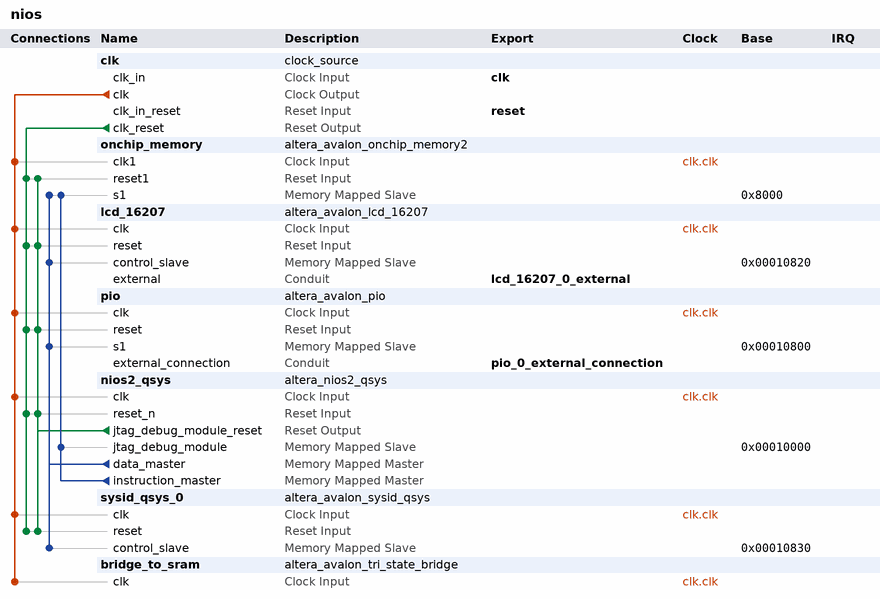
[diagram p0: system contents]
# Platform Designer (Qsys) system nios, Cyclone II EP2C35F672C6
# Parameters at their usual value, and those the tool derives, are not listed.
package require -exact qsys 13.0
create_system nios
set_project_property DEVICE_FAMILY {Cyclone II}
set_project_property DEVICE EP2C35F672C6

add_instance clk clock_source 13.0
set_instance_parameter_value clk clockFrequency 50000000

add_instance onchip_memory altera_avalon_onchip_memory2 13.0.1.99.2
set_instance_parameter_value onchip_memory dataWidth 32
set_instance_parameter_value onchip_memory dualPort false
set_instance_parameter_value onchip_memory initMemContent true
set_instance_parameter_value onchip_memory initializationFileName D:/DE2/nios_test/software/HelloWorld/mem_init/nios_onchip_memory.hex
set_instance_parameter_value onchip_memory memorySize 32768
set_instance_parameter_value onchip_memory useNonDefaultInitFile true

add_instance lcd_16207 altera_avalon_lcd_16207 13.0.1.99.2

add_instance pio altera_avalon_pio 13.0.1.99.2
set_instance_parameter_value pio bitModifyingOutReg true
set_instance_parameter_value pio direction Output
set_instance_parameter_value pio width 17

add_instance nios2_qsys altera_nios2_qsys 13.0
set_instance_parameter_value nios2_qsys resetSlave onchip_memory.s1
set_instance_parameter_value nios2_qsys mmu_TLBMissExcSlave None
set_instance_parameter_value nios2_qsys exceptionSlave onchip_memory.s1
set_instance_parameter_value nios2_qsys breakSlave nios2_qsys.jtag_debug_module
set_instance_parameter_value nios2_qsys impl Tiny
set_instance_parameter_value nios2_qsys icache_size 4096

add_instance sysid_qsys_0 altera_avalon_sysid_qsys 13.0
set_instance_parameter_value sysid_qsys_0 id 591751049

add_instance bridge_to_sram altera_avalon_tri_state_bridge 13.0
set_instance_parameter_value bridge_to_sram registerIncomingSignals true

# connections
add_connection clk.clk bridge_to_sram.clk clock
add_connection clk.clk lcd_16207.clk clock
add_connection clk.clk nios2_qsys.clk clock
add_connection clk.clk onchip_memory.clk1 clock
add_connection clk.clk pio.clk clock
add_connection clk.clk sysid_qsys_0.clk clock
add_connection clk.clk_reset lcd_16207.reset reset
add_connection clk.clk_reset nios2_qsys.reset_n reset
add_connection clk.clk_reset onchip_memory.reset1 reset
add_connection clk.clk_reset pio.reset reset
add_connection clk.clk_reset sysid_qsys_0.reset reset
add_connection nios2_qsys.jtag_debug_module_reset lcd_16207.reset reset
add_connection nios2_qsys.jtag_debug_module_reset nios2_qsys.reset_n reset
add_connection nios2_qsys.jtag_debug_module_reset onchip_memory.reset1 reset
add_connection nios2_qsys.jtag_debug_module_reset pio.reset reset
add_connection nios2_qsys.jtag_debug_module_reset sysid_qsys_0.reset reset
add_connection nios2_qsys.data_master lcd_16207.control_slave avalon
set_connection_parameter_value nios2_qsys.data_master/lcd_16207.control_slave baseAddress 0x00010820
add_connection nios2_qsys.data_master onchip_memory.s1 avalon
set_connection_parameter_value nios2_qsys.data_master/onchip_memory.s1 baseAddress 0x8000
add_connection nios2_qsys.data_master pio.s1 avalon
set_connection_parameter_value nios2_qsys.data_master/pio.s1 baseAddress 0x00010800
add_connection nios2_qsys.data_master sysid_qsys_0.control_slave avalon
set_connection_parameter_value nios2_qsys.data_master/sysid_qsys_0.control_slave baseAddress 0x00010830
add_connection nios2_qsys.instruction_master nios2_qsys.jtag_debug_module avalon
set_connection_parameter_value nios2_qsys.instruction_master/nios2_qsys.jtag_debug_module baseAddress 0x00010000
add_connection nios2_qsys.instruction_master onchip_memory.s1 avalon
set_connection_parameter_value nios2_qsys.instruction_master/onchip_memory.s1 baseAddress 0x8000

# exported interfaces
add_interface clk clock sink
set_interface_property clk EXPORT_OF clk.clk_in
add_interface pio_0_external_connection conduit end
set_interface_property pio_0_external_connection EXPORT_OF pio.external_connection
add_interface lcd_16207_0_external conduit end
set_interface_property lcd_16207_0_external EXPORT_OF lcd_16207.external
add_interface reset reset sink
set_interface_property reset EXPORT_OF clk.clk_in_reset

set_interconnect_requirement {$system} qsys_mm.clockCrossingAdapter HANDSHAKE
set_interconnect_requirement {$system} qsys_mm.maxAdditionalLatency 1

save_system nios.qsys
